# Altium schematic sheet LV8548MC测试板-V1.0.SchDoc
size A4
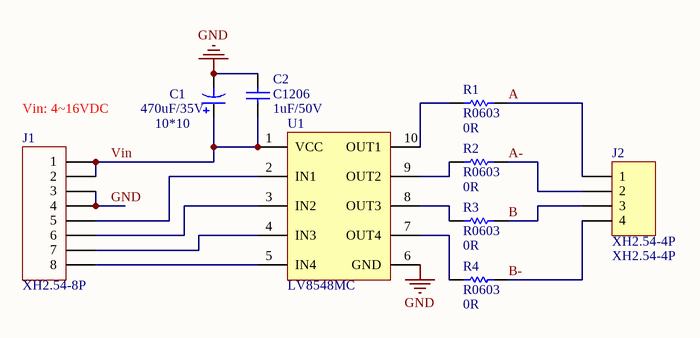
[diagram p0: LV8548MC测试板-V1.0.SchDoc]

## Parts
C1  470uF/35V  value 10*10  [CAP_SO_10*10]
C2  C1206  value 1uF/50V  [1206]
J1  value XH2.54-8P  [XH2.54-8]  (hidden comment: PH2.0-8P)
J2  XH2.54-4P  [XH2.54-4]
R1  R0603  value 0R  [0603]
R2  R0603  value 0R  [0603]
R3  R0603  value 0R  [0603]
R4  R0603  value 0R  [0603]
U1  LV8548MC  [SOIC10]

## Nets
GND: C1.2 C2.2 J1.3 J1.4 U1.6(GND)
A: J2.1 R1.1
A-: J2.2 R2.1
B: J2.3 R3.1
B-: J2.4 R4.1
Vin: C1.1 C2.1 J1.1 J1.2 U1.1(VCC)
NetJ1_5: J1.5 U1.2(IN1)
NetJ1_6: J1.6 U1.3(IN2)
NetJ1_7: J1.7 U1.4(IN3)
NetJ1_8: J1.8 U1.5(IN4)
NetR1_2: R1.2 U1.10(OUT1)
NetR2_2: R2.2 U1.9(OUT2)
NetR3_2: R3.2 U1.8(OUT3)
NetR4_2: R4.2 U1.7(OUT4)

## Notes on the sheet
- (near J1) Vin: 4~16VDC

## Library data of the parts
C1 = Cap Pol3: Polarized Capacitor (Surface Mount); Published: 8-Jun-2000; LatestRevisionDate: 29-May-2009; LatestRevisionNote: IPC-7351 Footprint Added.; PackageReference: C0805; Publisher: Altium Limited; PackageDescription: Chip Capacitor
C2 = Cap: Capacitor; Published: 8-Jun-2000; LatestRevisionDate: 17-Jul-2002; LatestRevisionNote: Re-released for DXP Platform.; PackageReference: RAD-0.3; Publisher: Altium Limited; PackageDescription: Radial Cap, Thru-Hole; 2 Leads; 0.3 in Pin Spacing
J1 = PH2.0-8P: Header, 6-Pin; LatestRevisionDate: 17-Jul-2002; LatestRevisionNote: Re-released for DXP Platform.; Publisher: Altium Limited
J2 = Header 4: Header, 4-Pin; LatestRevisionDate: 17-Jul-2002; LatestRevisionNote: Re-released for DXP Platform.; Publisher: Altium Limited; Value: XH2.54-4P
R1-R4 = Res1: Resistor; Published: 8-Jun-2000; LatestRevisionDate: 17-Jul-2002; LatestRevisionNote: Re-released for DXP Platform.; PackageReference: AXIAL-0.3; Publisher: Altium Limited; PackageDescription: Axial Device, Thru-Hole; 2 Leads; 0.3 in Pin Spacing